# Altium schematic sheet Communications.SchDoc
size A4
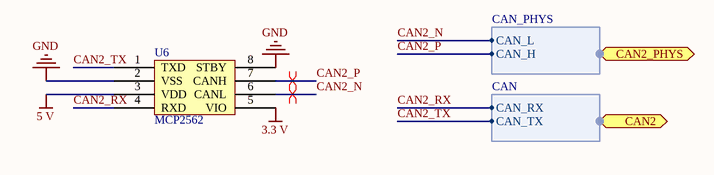
[diagram p0: Communications.SchDoc]

## Parts
U6  MCP2562  [MCP2562]

## Ports
CAN2 (harness CAN), CAN2_PHYS (harness CAN_PHYS)

## Harnesses
CAN_PHYS: CAN_L, CAN_H
CAN: CAN_RX, CAN_TX

## Nets
3.3 V: U6.5(VIO)
5 V: U6.3(VDD)
GND: U6.2(VSS) U6.8(STBY)
CAN2_N: U6.6(CANL) ; port CAN2_PHYS.CAN_L
CAN2_P: U6.7(CANH) ; port CAN2_PHYS.CAN_H
CAN2_RX: U6.4(RXD) ; port CAN2.CAN_RX
CAN2_TX: U6.1(TXD) ; port CAN2.CAN_TX

## Layout directives
differential pair: CAN2_N, CAN2_P